# Altium schematic sheet power_supply.SchDoc: Power supply
size A4; Organization: Zigman NIkita; Address3: zigman.nikita@gmail.com; DocumentNumber: 1.0; Revision: ZN; SheetNumber: 5; SheetTotal: 6
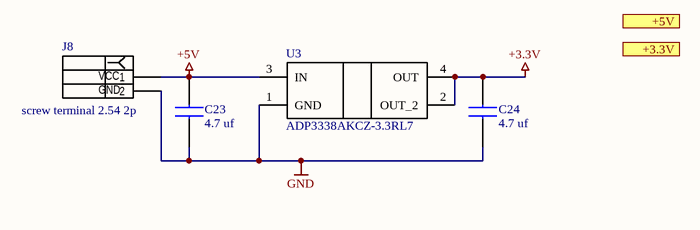
[diagram p0: power_supply.SchDoc]

## Parts
C23  4.7 uf  [CAPC1608X90N]
C24  4.7 uf  [CAPC1608X90N]
J8  screw terminal 2.54 2p  [1725672-2-2.54]
U3  ADP3338AKCZ-3.3RL7  [SOT230-3]

## Ports
+3.3V, +5V

## Nets
+3.3V: C24.2 U3.2(OUT_2) U3.4(OUT)
+5V: C23.2 J8.1 U3.3(IN)
GND: C23.1 C24.1 J8.2 U3.1(GND)

## Notes on the sheet
- Title
- Size:
- Date:
- A4
- Number:
- Time:
- Revision:
- Sheet
- of
- File:
- (in symbol screw terminal 2.54 2p) VCC; GND

## Library data of the parts
C23 C24 = 0603: AVX, SMD MLCC 4.7 uF 10 V dc, 0603; Datasheet Link: https://at.rs-online.com/web/p/keramik-vielschichtkondensatoren/1353676/; Height: 0.9mm; Manufacturer_Name: AVX
J8 = screw terminal 2.54 2p: Connector; Manufacturer_Name: Phoenix Contact; Manufacturer_Part_Number: 1725672; Datasheet Link: https://www.phoenixcontact.com/online/portal/us?uri=pxc-oc-itemdetail:pid=1725672&library=usen&tab=1.pdf; Arrow Part Number: 1725672; Arrow Price/Stock: https://www.arrow.com/en/products/1725672/phoenix-contact; Mouser Part Number: 651-1725672; Mouser Price/Stock: https://www.mouser.co.uk/ProductDetail/Phoenix-Contact/1725672?qs=Ul7CXFMnlWXX93F9bOV2pQ%3D%3D
U3 = ADP3338AKCZ-3.3RL7: Linear Voltage Regulator IC 1 Output 1A SOT-223-3; MF: Analog Devices; Value: *; Mouser-Purchase-URL: https://snapeda.com/shop?store=Mouser&id=51107; Package: SOT-223 Analog Devices; DigiKey-Purchase-URL: https://snapeda.com/shop?store=DigiKey&id=51107; Price: None; MP: ADP3338AKCZ-3.3RL7; Availability: Good; SnapEDA_Link: https://www.snapeda.com/parts/ADP3338AKCZ-3.3RL7/Analog%20Devices%20Inc./view-part/51107/?ref=snap; Arrow_Electronics-Purchase-URL: https://snapeda.com/shop?store=Arrow+Electronics&id=51107